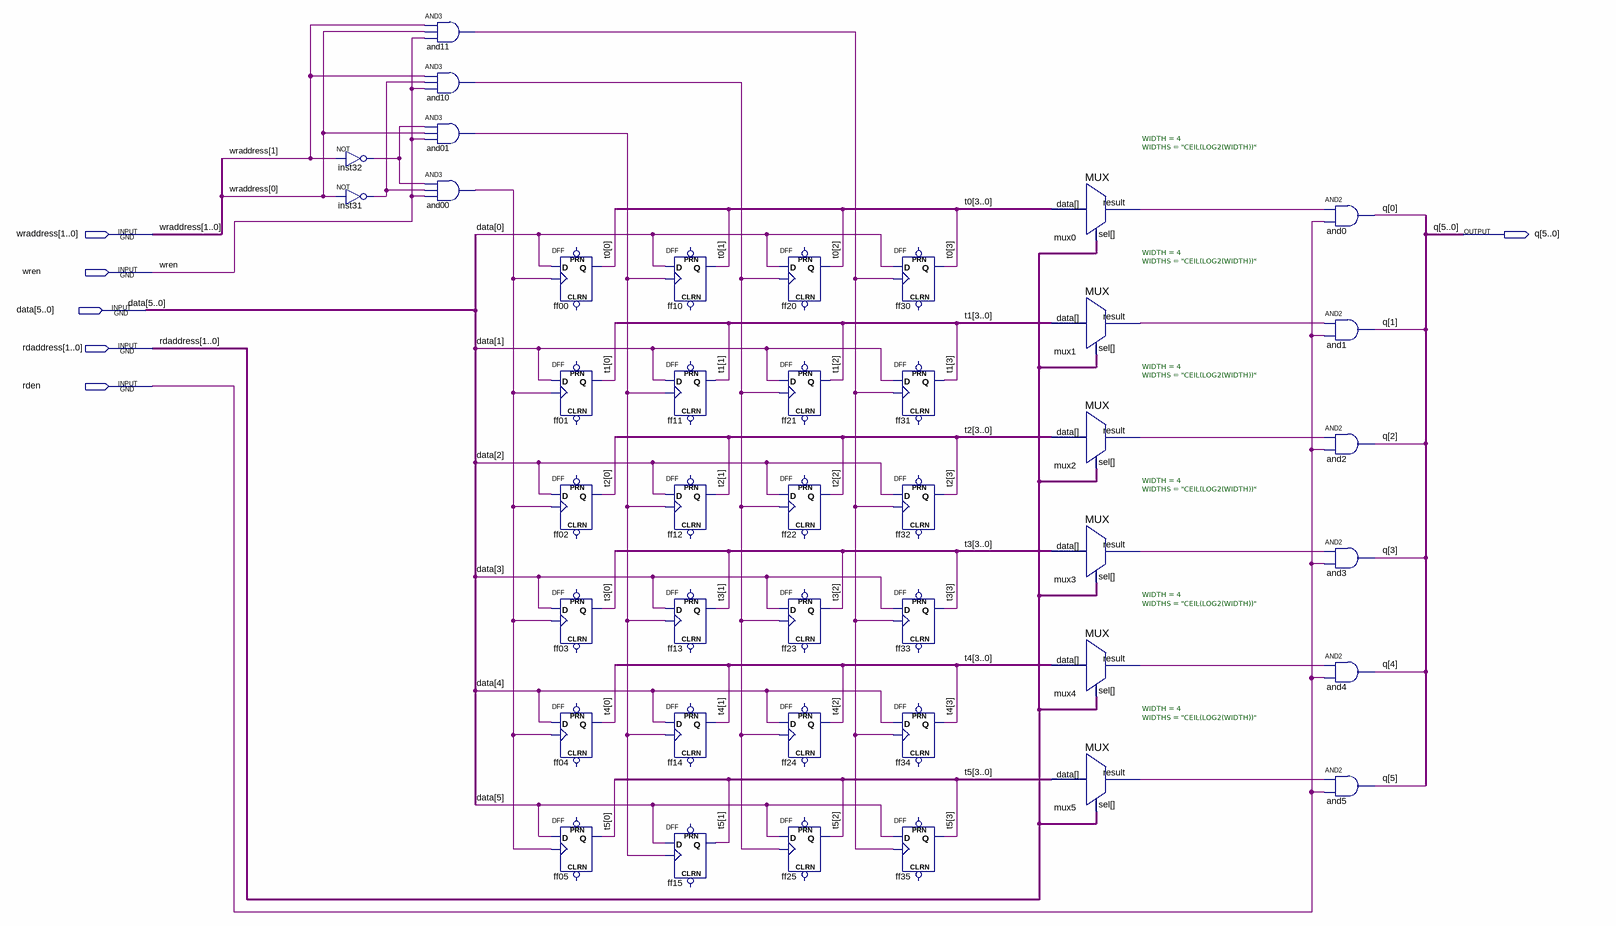
[diagram p0: schematic sheet]
// Quartus schematic page_reg_4x6_sch.bdf as structural Verilog: 42 symbols, 6 pins
module page_reg_4x6_sch (
  input  [1:0] wraddress,
  input  wren,
  input  [5:0] data,
  input  [1:0] rdaddress,
  input  rden,
  output [5:0] q
);

  wire and00_out, and01_out, and10_out, and11_out, inst31_out, inst32_out, mux0_result, mux1_result,
       mux2_result, mux3_result, mux4_result, mux5_result;
  wire [3:0] t0, t1, t2, t3, t4, t5;

  not inst32 (inst32_out, wraddress[1]);
  not inst31 (inst31_out, wraddress[0]);
  and and11 (and11_out, wraddress[1], wraddress[0], wren);
  and and10 (and10_out, wraddress[1], inst31_out, wren);
  and and01 (and01_out, inst32_out, wraddress[0], wren);
  and and00 (and00_out, inst32_out, inst31_out, wren);
  DFF ff00 (.CLK(and00_out), .D(data[0]), .Q(t0[0]));  // open: CLRN, PRN
  DFF ff01 (.CLK(and00_out), .D(data[1]), .Q(t1[0]));  // open: CLRN, PRN
  DFF ff02 (.CLK(and00_out), .D(data[2]), .Q(t2[0]));  // open: CLRN, PRN
  DFF ff03 (.CLK(and00_out), .D(data[3]), .Q(t3[0]));  // open: CLRN, PRN
  DFF ff04 (.CLK(and00_out), .D(data[4]), .Q(t4[0]));  // open: CLRN, PRN
  DFF ff05 (.CLK(and00_out), .D(data[5]), .Q(t5[0]));  // open: CLRN, PRN
  DFF ff10 (.CLK(and01_out), .D(data[0]), .Q(t0[1]));  // open: CLRN, PRN
  DFF ff11 (.CLK(and01_out), .D(data[1]), .Q(t1[1]));  // open: CLRN, PRN
  DFF ff12 (.CLK(and01_out), .D(data[2]), .Q(t2[1]));  // open: CLRN, PRN
  DFF ff13 (.CLK(and01_out), .D(data[3]), .Q(t3[1]));  // open: CLRN, PRN
  DFF ff14 (.CLK(and01_out), .D(data[4]), .Q(t4[1]));  // open: CLRN, PRN
  DFF ff15 (.CLK(and01_out), .D(data[5]), .Q(t5[1]));  // open: CLRN, PRN
  DFF ff20 (.CLK(and10_out), .D(data[0]), .Q(t0[2]));  // open: CLRN, PRN
  DFF ff21 (.CLK(and10_out), .D(data[1]), .Q(t1[2]));  // open: CLRN, PRN
  DFF ff22 (.CLK(and10_out), .D(data[2]), .Q(t2[2]));  // open: CLRN, PRN
  DFF ff23 (.CLK(and10_out), .D(data[3]), .Q(t3[2]));  // open: CLRN, PRN
  DFF ff24 (.CLK(and10_out), .D(data[4]), .Q(t4[2]));  // open: CLRN, PRN
  DFF ff25 (.CLK(and10_out), .D(data[5]), .Q(t5[2]));  // open: CLRN, PRN
  DFF ff30 (.CLK(and11_out), .D(data[0]), .Q(t0[3]));  // open: CLRN, PRN
  DFF ff31 (.CLK(and11_out), .D(data[1]), .Q(t1[3]));  // open: CLRN, PRN
  DFF ff32 (.CLK(and11_out), .D(data[2]), .Q(t2[3]));  // open: CLRN, PRN
  DFF ff33 (.CLK(and11_out), .D(data[3]), .Q(t3[3]));  // open: CLRN, PRN
  DFF ff34 (.CLK(and11_out), .D(data[4]), .Q(t4[3]));  // open: CLRN, PRN
  DFF ff35 (.CLK(and11_out), .D(data[5]), .Q(t5[3]));  // open: CLRN, PRN
  MUX #(.WIDTH(4), .WIDTHS("CEIL(LOG2(WIDTH))")) mux0 (.data(t0), .sel(rdaddress), .result(mux0_result));
  MUX #(.WIDTH(4), .WIDTHS("CEIL(LOG2(WIDTH))")) mux1 (.data(t1), .sel(rdaddress), .result(mux1_result));
  MUX #(.WIDTH(4), .WIDTHS("CEIL(LOG2(WIDTH))")) mux2 (.data(t2), .sel(rdaddress), .result(mux2_result));
  MUX #(.WIDTH(4), .WIDTHS("CEIL(LOG2(WIDTH))")) mux3 (.data(t3), .sel(rdaddress), .result(mux3_result));
  MUX #(.WIDTH(4), .WIDTHS("CEIL(LOG2(WIDTH))")) mux4 (.data(t4), .sel(rdaddress), .result(mux4_result));
  MUX #(.WIDTH(4), .WIDTHS("CEIL(LOG2(WIDTH))")) mux5 (.data(t5), .sel(rdaddress), .result(mux5_result));
  and and0 (q[0], mux0_result, rden);
  and and1 (q[1], mux1_result, rden);
  and and2 (q[2], mux2_result, rden);
  and and3 (q[3], mux3_result, rden);
  and and4 (q[4], mux4_result, rden);
  and and5 (q[5], mux5_result, rden);
endmodule
